# EAGLE design tick-mini-mk-4.1 (EAGLE 6.5.0)
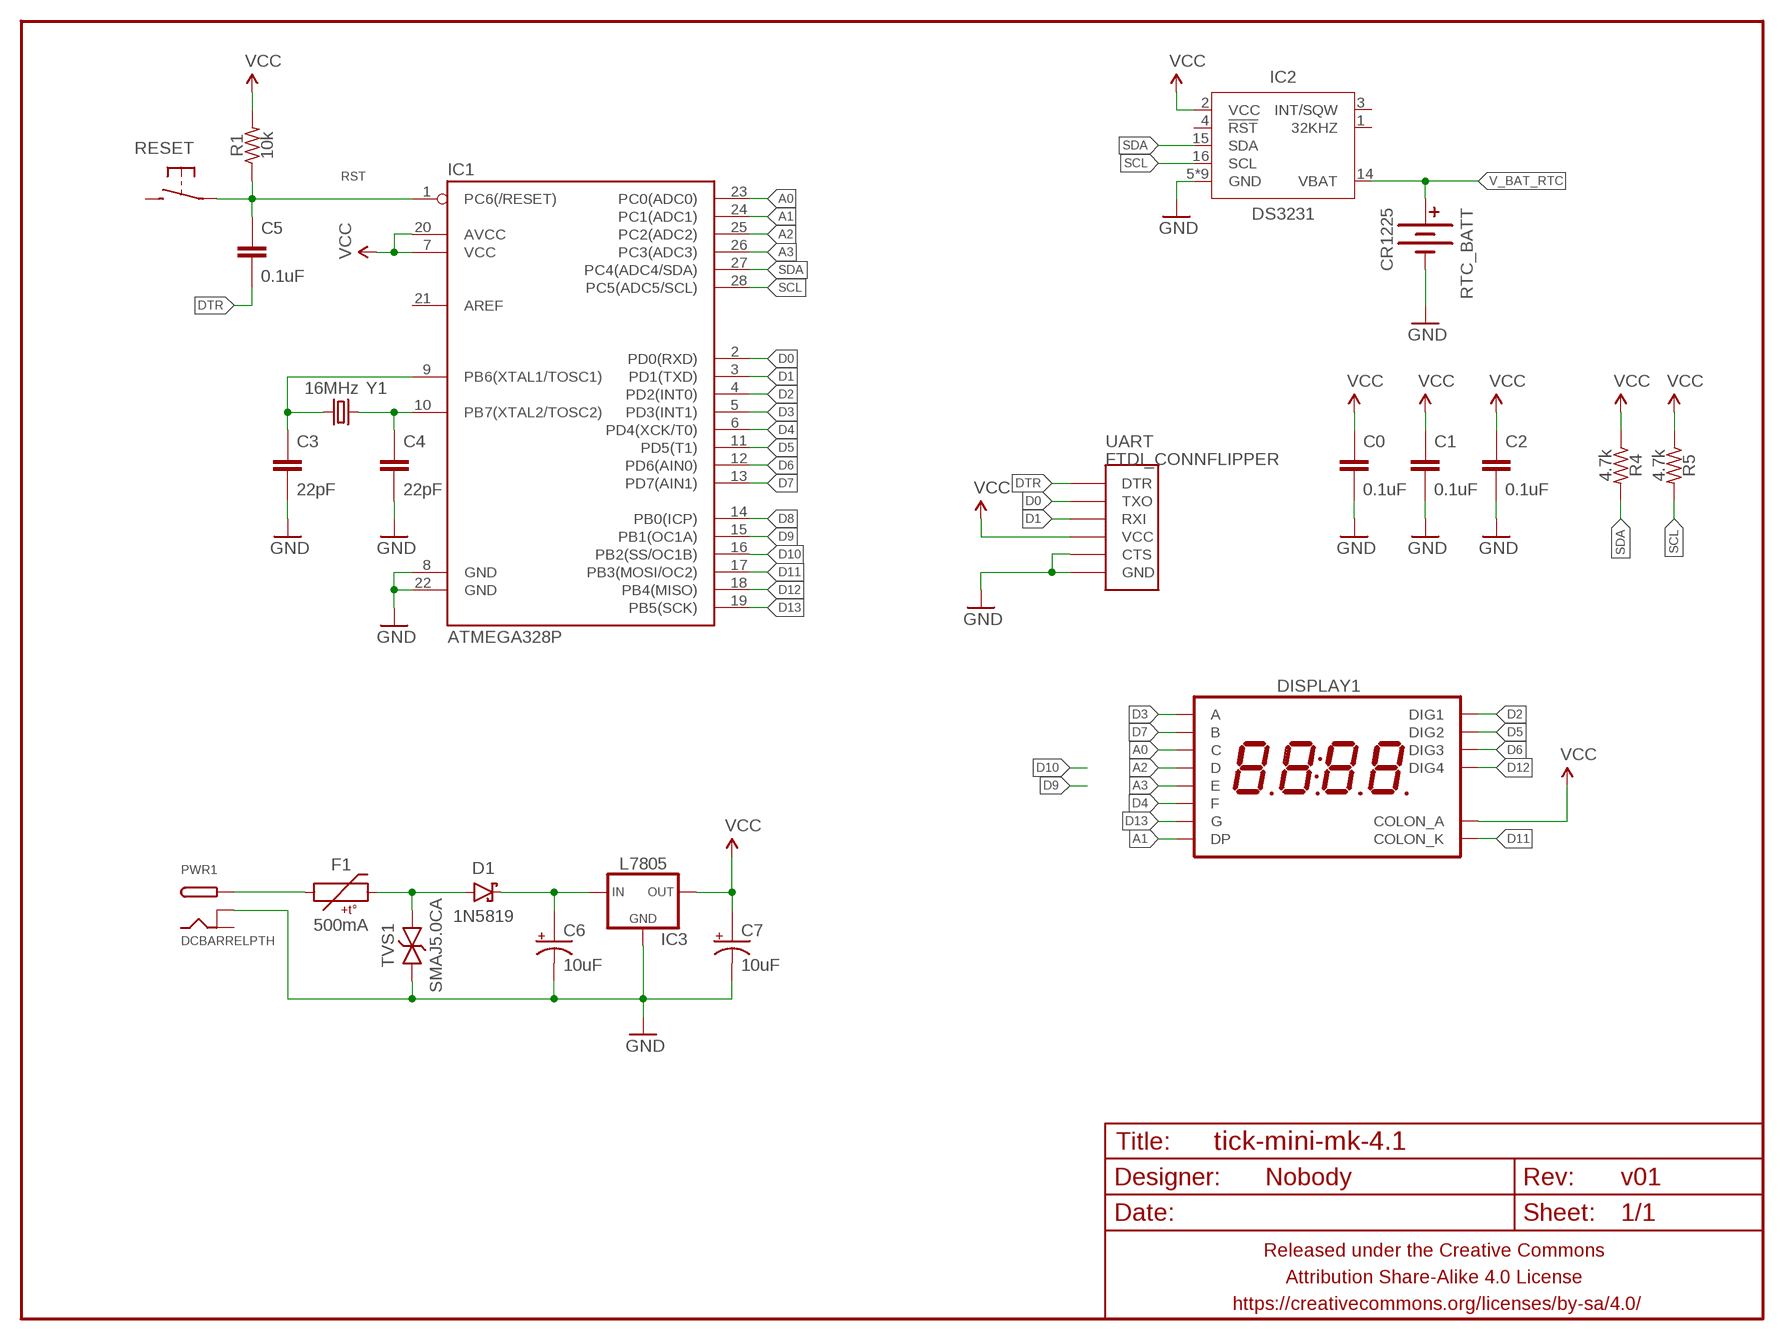
[diagram p0: schematic, sheet 1]

## Parts
C0  0.1uF  CAPACITOR-CERAMIC025-024X044  [C025-024X044]
C1  0.1uF  CAPACITOR-CERAMIC025-024X044  [C025-024X044]
C2  0.1uF  CAPACITOR-CERAMIC025-024X044  [C025-024X044]
C3  22pF  CAPACITOR-CERAMIC025-024X044  [C025-024X044]
C4  22pF  CAPACITOR-CERAMIC025-024X044  [C025-024X044]
C5  0.1uF  CAPACITOR-CERAMIC025-024X044  [C025-024X044]
C6  10uF  CAPACITOR-POLARIZEDE2-5  [E2-5]
C7  10uF  CAPACITOR-POLARIZEDE2-5  [E2-5]
D1  1N5819  DIODE-SCHOTTKYPTH-10.16MM  [DIODE-10.16MM]
DISPLAY1  7SEG_4DIGIT_COLON14.2MM-CC-NS  [7SEG_4DIG_NS]
F1  500mA  PTCPTH-5.08MM  [PTC-PTH-5.08MM]
FRAME1  FRAME-LETTERNO_PACKAGE  [DUMMY]
IC1  ATMEGA328P  ATMEGA328P_PDIP  [DIL28-3]
IC2  DS3231  [SO16W]
IC3  L7805  V_REG_78XXTO-92-INLINE  [TO-92-AMMO]
PWR1  DCBARRELPTH  [DCJACK_2MM_PTH]
R1  10k  RESISTORPTH-AXIAL-7.62MM  [RESISTOR-AXIAL-PTH-7.62MM]
R4  4.7k  RESISTORPTH-AXIAL-7.62MM  [RESISTOR-AXIAL-PTH-7.62MM]
R5  4.7k  RESISTORPTH-AXIAL-7.62MM  [RESISTOR-AXIAL-PTH-7.62MM]
RESET  SPST-NO-TACT6MM-PTH-SMALL-PADS  [DTS-6-SMALL-PADS]
RTC_BATT  CR1225  BATTERY12MM  [BATTCON_12MM]
TVS1  SMAJ5.0CA  TVSDO-41-10.16MM  [DO-41-TVS-BI-10.16MM]
UART  FTDI_CONNFLIPPER  [FTDI_CONN_FLIP]
Y1  16MHz  CRYSTALHC49UV  [HC49U-V]

## Nets
A0: DISPLAY1.P$4(C) IC1.23(PC0(ADC0))
A1: DISPLAY1.P$3(DP) IC1.24(PC1(ADC1))
A2: DISPLAY1.P$2(D) IC1.25(PC2(ADC2))
A3: DISPLAY1.P$1(E) IC1.26(PC3(ADC3))
D0: IC1.2(PD0(RXD)) UART.TXO
D1: IC1.3(PD1(TXD)) UART.RXI
D2: DISPLAY1.P$14(DIG1) IC1.4(PD2(INT0))
D3: DISPLAY1.P$13(A) IC1.5(PD3(INT1))
D4: DISPLAY1.P$12(F) IC1.6(PD4(XCK/T0))
D5: DISPLAY1.P$11(DIG2) IC1.11(PD5(T1))
D6: DISPLAY1.P$10(DIG3) IC1.12(PD6(AIN0))
D7: DISPLAY1.P$9(B) IC1.13(PD7(AIN1))
D8: IC1.14(PB0(ICP))
D9: IC1.15(PB1(OC1A))
D10: IC1.16(PB2(SS/OC1B))
D11: DISPLAY1.P$7(COLON_K) IC1.17(PB3(MOSI/OC2))
D12: DISPLAY1.P$6(DIG4) IC1.18(PB4(MISO))
D13: DISPLAY1.P$5(G) IC1.19(PB5(SCK))
DTR: C5.2 UART.DTR
GND: C0.2 C1.2 C2.2 C3.2 C4.2 C6.- C7.- IC1.8(GND) IC1.22(GND) IC2.5(GND) IC2.6(GND) IC2.7(GND) IC2.8(GND) IC2.9(GND) IC2.10(GND) IC2.11(GND) IC2.12(GND) IC2.13(GND) IC3.2(GND) PWR1.BRK RTC_BATT.GND(-) TVS1.P$1 UART.CTS UART.GND
N$1: C4.1 IC1.10(PB7(XTAL2/TOSC2)) Y1.1
N$2: C3.1 IC1.9(PB6(XTAL1/TOSC1)) Y1.2
N$3: D1.A F1.P$2 TVS1.P$2
N$5: F1.P$1 PWR1.PWR
N$8: C6.+ D1.C IC3.1(IN)
RST: C5.1 IC1.1(PC6(/RESET)) R1.P$1 RESET.1 RESET.2
SCL: IC1.28(PC5(ADC5/SCL)) IC2.16(SCL) R5.P$2
SDA: IC1.27(PC4(ADC4/SDA)) IC2.15(SDA) R4.P$2
V_BAT_RTC: IC2.14(VBAT) RTC_BATT.PWR@1(+)
VCC: C0.1 C1.1 C2.1 C7.+ DISPLAY1.P$8(COLON_A) IC1.7(VCC) IC1.20(AVCC) IC2.2(VCC) IC3.3(OUT) R1.P$2 R4.P$1 R5.P$1 UART.VCC
Unconnected: IC1.21(AREF) IC2.1(32KHZ) IC2.3(INT/SQW) IC2.4(!RST) PWR1.GND RESET.3 RESET.4

## Library data of the parts
C0 C1-C5 = A_butts:CAPACITOR-CERAMIC: CAPACITOR, European symbol
C6 C7 = A_butts:CAPACITOR-POLARIZED: POLARIZED CAPACITOR, American symbol
D1 = A_butts:DIODE-SCHOTTKY: Schottky diodes in SFE's production catalog BAT20J 1A 23V 0.62Vf RB751 120mA 40V 0.37Vf PMEG4005EJ 0.5A 40V 0.42Vf MBRA140 1A 40V 0.5Vf B340A 3A 40V SMA
DISPLAY1 = A_butts:7SEG_4DIGIT_COLON
F1 = A_butts:PTC: Resettable Fuse PTC Resettable Fuse. Spark Fun Electronics SKU : COM-08357
FRAME1 = A_butts:FRAME-LETTER: Schematic Frame Standard 8.5x11 US Letter frame; DESIGNER: Nobody; VERSION: v01
IC1 = A_butts:ATMEGA328P_PDIP: uC used in the Arduino 32kb flash, 1k EEPROM, 2k SRAM This is the through-hole version of this chip.
IC2 = A_butts:DS3231
IC3 = A_butts:V_REG_78XX: Voltage Regulator Standard 7805 5V regulator. IGO (Input Ground Output). Spark Fun Electronics SKU : COM-00107
PWR1 = A_butts:DCBARREL: 2.0mm DC Barrel Jack DCJACK_2MM_PTH - Through Hole Jack (4UConnector: 05537)
R1 R4 R5 = A_butts:RESISTOR: RESISTOR, American symbol
RESET = A_butts:SPST-NO-TACT
RTC_BATT = A_butts:BATTERY: Battery Holders Various common sizes : AA, AAA, 20mm coin cell and 12mm coin cell. 20MM_4LEGS, BATT-10373
TVS1 = A_butts:TVS: Transient voltage suppressor- prevents ESD on inputs. Ignore package description- MBRA140 is NOT this type of part!!!
UART = A_butts:FTDI_CONN: Connector which mates to FTDI basic or FTDI cable.
Y1 = A_butts:CRYSTAL: Various standard crystals. Proven footprints. Spark Fun Electronics SKU : COM-00534

## Board
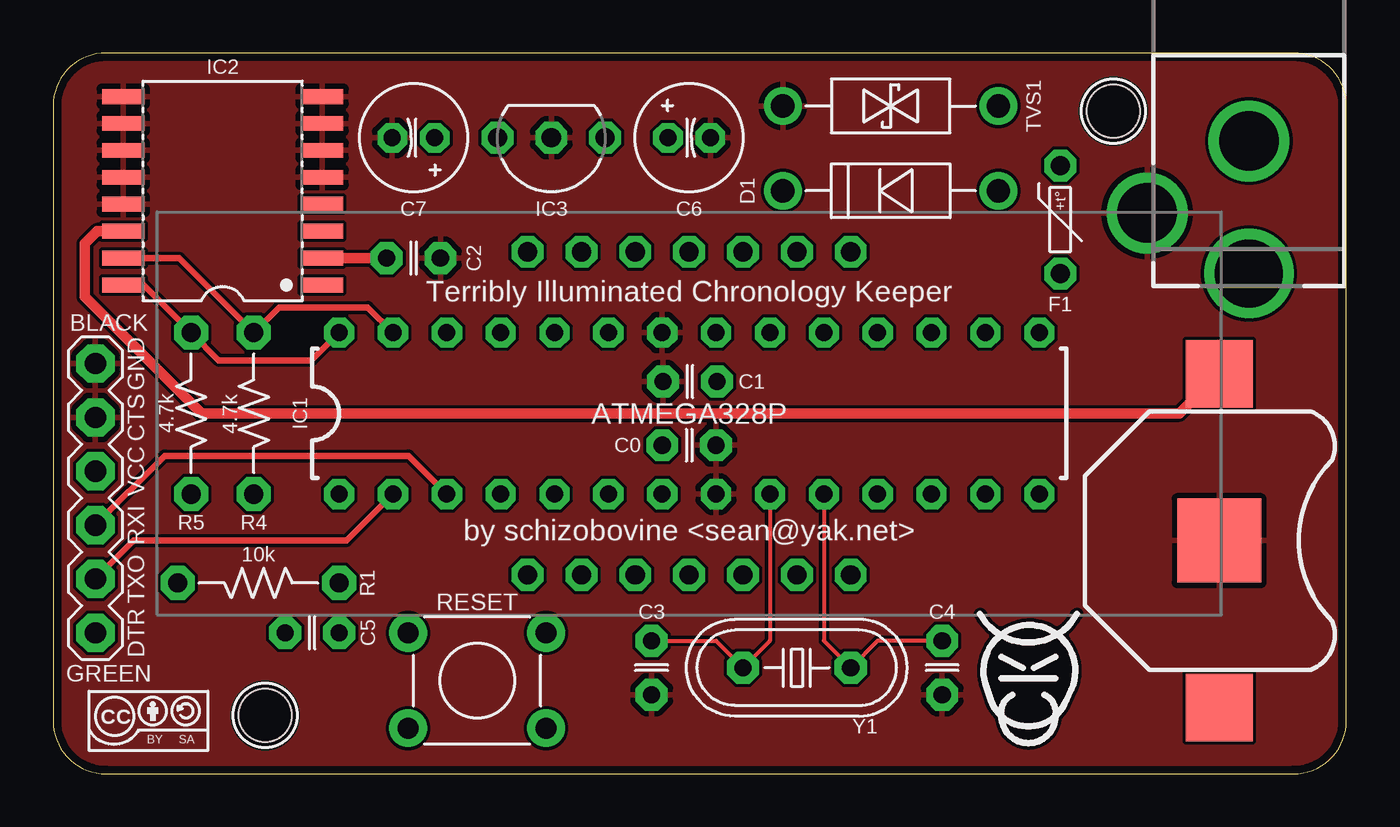
[diagram p1: board, top side]
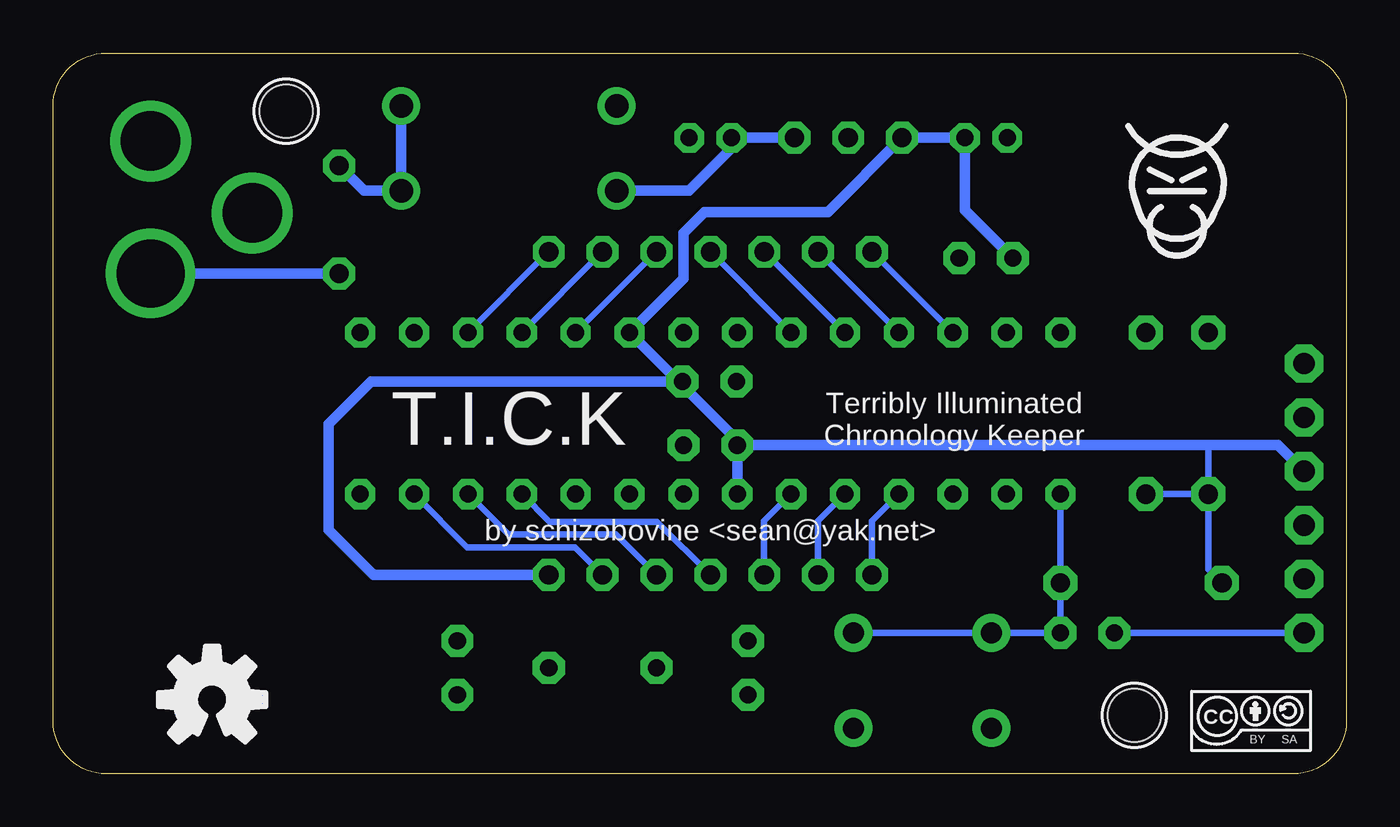
[diagram p2: board, bottom side, seen from below]

Size 61 x 34 mm. Coordinates in mm from the lower left corner, seen from the top.
Outline: 0,31.5 0,2.5 arc90 2.5,0 58.5,0 arc90 61,2.5 61,31.5 arc90 58.5,34 2.5,34 arc90 0,31.5
Copper layers (1*16): Top 0.0356mm / dielectric 1.5011mm / Bottom 0.0356mm
Design rules "LaenPCBOrder_2": minimum track width 6mil, minimum drill 13mil, track to track 6mil, track to pad 6mil, pad to pad 6mil, via to via 6mil, smd to smd 6mil, copper to edge 15mil, drill to drill 6mil, minimum pad ring 7mil, minimum via ring 7mil, stop-mask expansion 3mil, vias tented up to drill 20mil, thermal gap 10mil
Holes 2.5 mm at 50,31.25 10,2.75

### Footprints (pad centres in the part's own frame; a part is rotated, then mirrored left to right if it is on the bottom)
C025-024X044 = drill 0.813 pad 1.5 octagon: 1 -1.27,0; 2 1.27,0
E2-5 = drill 0.8 pad 1.4 octagon: + -1,0; - 1,0
DIODE-10.16MM = drill 1.1 pad 1.778: A -5.08,0; C 5.08,0
7SEG_4DIG_NS = drill 0.9 pad 1.5 octagon: P$1 -7.62,7.62; P$2 -5.08,7.62; P$3 -2.54,7.62; P$4 0,7.62; P$5 2.54,7.62; P$6 5.08,7.62; P$7 7.62,7.62; P$8 7.62,-7.62; P$9 5.08,-7.62; P$10 2.54,-7.62; P$11 0,-7.62; P$12 -2.54,-7.62; P$13 -5.08,-7.62; P$14 -7.62,-7.62
PTC-PTH-5.08MM = drill 0.9 pad 1.5 octagon: P$1 -2.54,0; P$2 2.54,0
DIL28-3 = drill 0.8 pad 1.422 octagon: 1 -16.51,-3.81; 2 -13.97,-3.81; 3 -11.43,-3.81; 4 -8.89,-3.81; 5 -6.35,-3.81; 6 -3.81,-3.81; 7 -1.27,-3.81; 8 1.27,-3.81; 9 3.81,-3.81; 10 6.35,-3.81; 11 8.89,-3.81; 12 11.43,-3.81; 13 13.97,-3.81; 14 16.51,-3.81; 15 16.51,3.81; 16 13.97,3.81; 17 11.43,3.81; 18 8.89,3.81; 19 6.35,3.81; 20 3.81,3.81; 21 1.27,3.81; 22 -1.27,3.81; 23 -3.81,3.81; 24 -6.35,3.81; 25 -8.89,3.81; 26 -11.43,3.81; 27 -13.97,3.81; 28 -16.51,3.81
SO16W = smd 0.7 x 2: 1 -4.445,-4.685; 2 -3.175,-4.685; 3 -1.905,-4.685; 4 -0.635,-4.685; 5 0.635,-4.685; 6 1.905,-4.685; 7 3.175,-4.685; 8 4.445,-4.685; 9 4.445,4.685; 10 3.175,4.685; 11 1.905,4.685; 12 0.635,4.685; 13 -0.635,4.685; 14 -1.905,4.685; 15 -3.175,4.685; 16 -4.445,4.685
TO-92-AMMO = drill 0.9 pad 1.5 octagon: 1 -2.54,0; 2 0,0; 3 2.54,0
DCJACK_2MM_PTH = drill 2.8: BRK -4.8,2.85; GND 0,6.25 | drill 3.2: PWR 0,0
RESISTOR-AXIAL-PTH-7.62MM = drill 0.9 pad 1.6 octagon: P$1 -3.81,0; P$2 3.81,0
DTS-6-SMALL-PADS = drill 1 pad 1.778: 1 -3.25,2.25; 2 3.25,2.25; 3 -3.25,-2.25; 4 3.25,-2.25
BATTCON_12MM = smd 3.962 x 3.962: GND 0,0 | smd 3.175 x 3.175: PWR@1 -7.874,0; PWR@2 7.874,0
DO-41-TVS-BI-10.16MM = drill 1.1 pad 1.778: P$1 -5.08,0; P$2 5.08,0
FTDI_CONN_FLIP = drill 1 pad 1.8 octagon: CTS 3.81,0; DTR -6.35,0; GND 6.35,0; RXI -1.27,0; TXO -3.81,0; VCC 1.27,0
HC49U-V = drill 0.813 pad 1.524 octagon: 1 -2.54,0; 2 2.54,0

### Placement (x,y rotation side)
C0  30,15.5 0 top
C1  30.04,18.5 180 top
C2  17,24.32 0 top
C3  28.23,5 270 top
C4  41.93,5 270 top
C5  12.22,6.65 180 top
C6  30,30 0 top
C7  17,30 180 top
D1  39.5,27.5 180 top
DISPLAY1  30,17 0 top
F1  47.5,26.14 90 top
FRAME1  0,0 0 top
IC1  30,17 0 top
IC2  8,27.5 90 top
IC3  23.5,30 180 top
PWR1  56.4,23.6 0 top
R1  9.68,9 180 top
R4  9.47,17 90 top
R5  6.51,17 90 top
RESET  20,4.4 0 top
RTC_BATT  55,11 270 top
TVS1  39.5,31.5 0 top
U$1  [CC-BY-SA-4.0-NO-URL]  4.5,2.5 0 bottom
U$2  [COW_SMALL_METAL_NOTEXT]  46,5 0 top
U$3  [OSHWLOGO_TOP_0.2]  53.5,3.5 0 bottom
U$4  [COW_SMALL_METAL_NOTEXT]  8,28 0 bottom
U$5  [CC-BY-SA-4.0-NO-URL]  4.5,2.5 0 top
UART  2,13 90 top
Y1  35.08,5 180 top

### Tracks (layer width: path | path; a pad name or v marks a point on that pad's centre or on a via)
A0
  Bottom 0.3: IC1.23 DISPLAY1.P$4
A1
  Bottom 0.3: IC1.24 DISPLAY1.P$3
A2
  Bottom 0.3: IC1.25 DISPLAY1.P$2
A3
  Bottom 0.3: IC1.26 DISPLAY1.P$1
D0
  Top 0.3: UART.TXO 3.81,11 13.84,11 IC1.2
D1
  Top 0.3: UART.RXI 5.27,15 16.76,15 IC1.3
D2
  Bottom 0.3: DISPLAY1.P$14 22.38,11.92 IC1.4
D3
  Bottom 0.3: DISPLAY1.P$13 24.92,11.92 IC1.5
D4
  Bottom 0.3: DISPLAY1.P$12 27.46,11.92 IC1.6
D5
  Bottom 0.3: IC1.11 37.59,11.88 32.51,11.88 DISPLAY1.P$11
D6
  Bottom 0.3: IC1.12 39.52,11.29 34.45,11.29 DISPLAY1.P$10
D7
  Bottom 0.3: IC1.13 41.47,10.69 36.38,10.69 DISPLAY1.P$9
D11
  Bottom 0.3: DISPLAY1.P$7 IC1.17
D12
  Bottom 0.3: DISPLAY1.P$6 IC1.18
D13
  Bottom 0.3: DISPLAY1.P$5 IC1.19
DTR
  Bottom 0.3: UART.DTR C5.2
GND
  pour Top: -0.1,34.1 61.1,34.1 61.1,-0.1 -0.1,-0.1
N$1
  Top 0.2: IC1.10 36.35,6.27 Y1.1 38.89,6.27 C4.1
N$2
  Top 0.2: IC1.9 33.81,6.27 Y1.2 31.27,6.27 C3.1
N$3
  Bottom 0.5: F1.P$2 46.32,27.5 D1.A TVS1.P$2
N$5
  Bottom 0.5: PWR1.PWR F1.P$1
N$8
  Bottom 0.5: C6.+ 29,29.5 | 29,29.5 31,27.5 D1.C | IC3.1 28.5,30 29,29.5
RST
  Bottom 0.3: IC1.1 R1.P$1 C5.1 RESET.1 RESET.2
SCL
  Top 0.3: IC2.16 4.26,23.05 R5.P$2 7.82,19.5 12.18,19.5 IC1.28
SDA
  Top 0.3: IC2.15 5.96,24.32 R4.P$2 10.66,22 14.84,22 IC1.27
V_BAT_RTC
  Top 0.5: IC2.14 2.1,25.59 1.5,25 1.5,22.5 7,17 53.13,17 RTC_BATT.PWR@1
VCC
  Top 0.5: IC2.2 C2.1
  Bottom 0.3: R5.P$1 6.51,15.49 6.5,15.5 | R5.P$1 6.51,9.64 R1.P$2 | R5.P$1 R4.P$1
  Bottom 0.5: C1.1 31.5,18.5 IC1.20 31.27,23.35 31.27,25.5 30.27,26.5 24.46,26.5 IC3.3 C7.+ 18,26.59 C2.1 | C0.1 28.73,15.73 31.31,18.31 C1.1 | C0.1 IC1.7 | DISPLAY1.P$8 45.88,9.38 48,11.5 48,16.5 46,18.5 C1.1 | UART.VCC 3.23,15.5 6.5,15.5 C0.1

### Text on the board
tPlace: Terribly Illuminated Chronology Keeper | by schizobovine <sean@yak.net>
bPlace: Terribly Illuminated / Chronology Keeper | T.I.C.K | by schizobovine <sean@yak.net>